# EAGLE schematic coke (EAGLE 5.06)
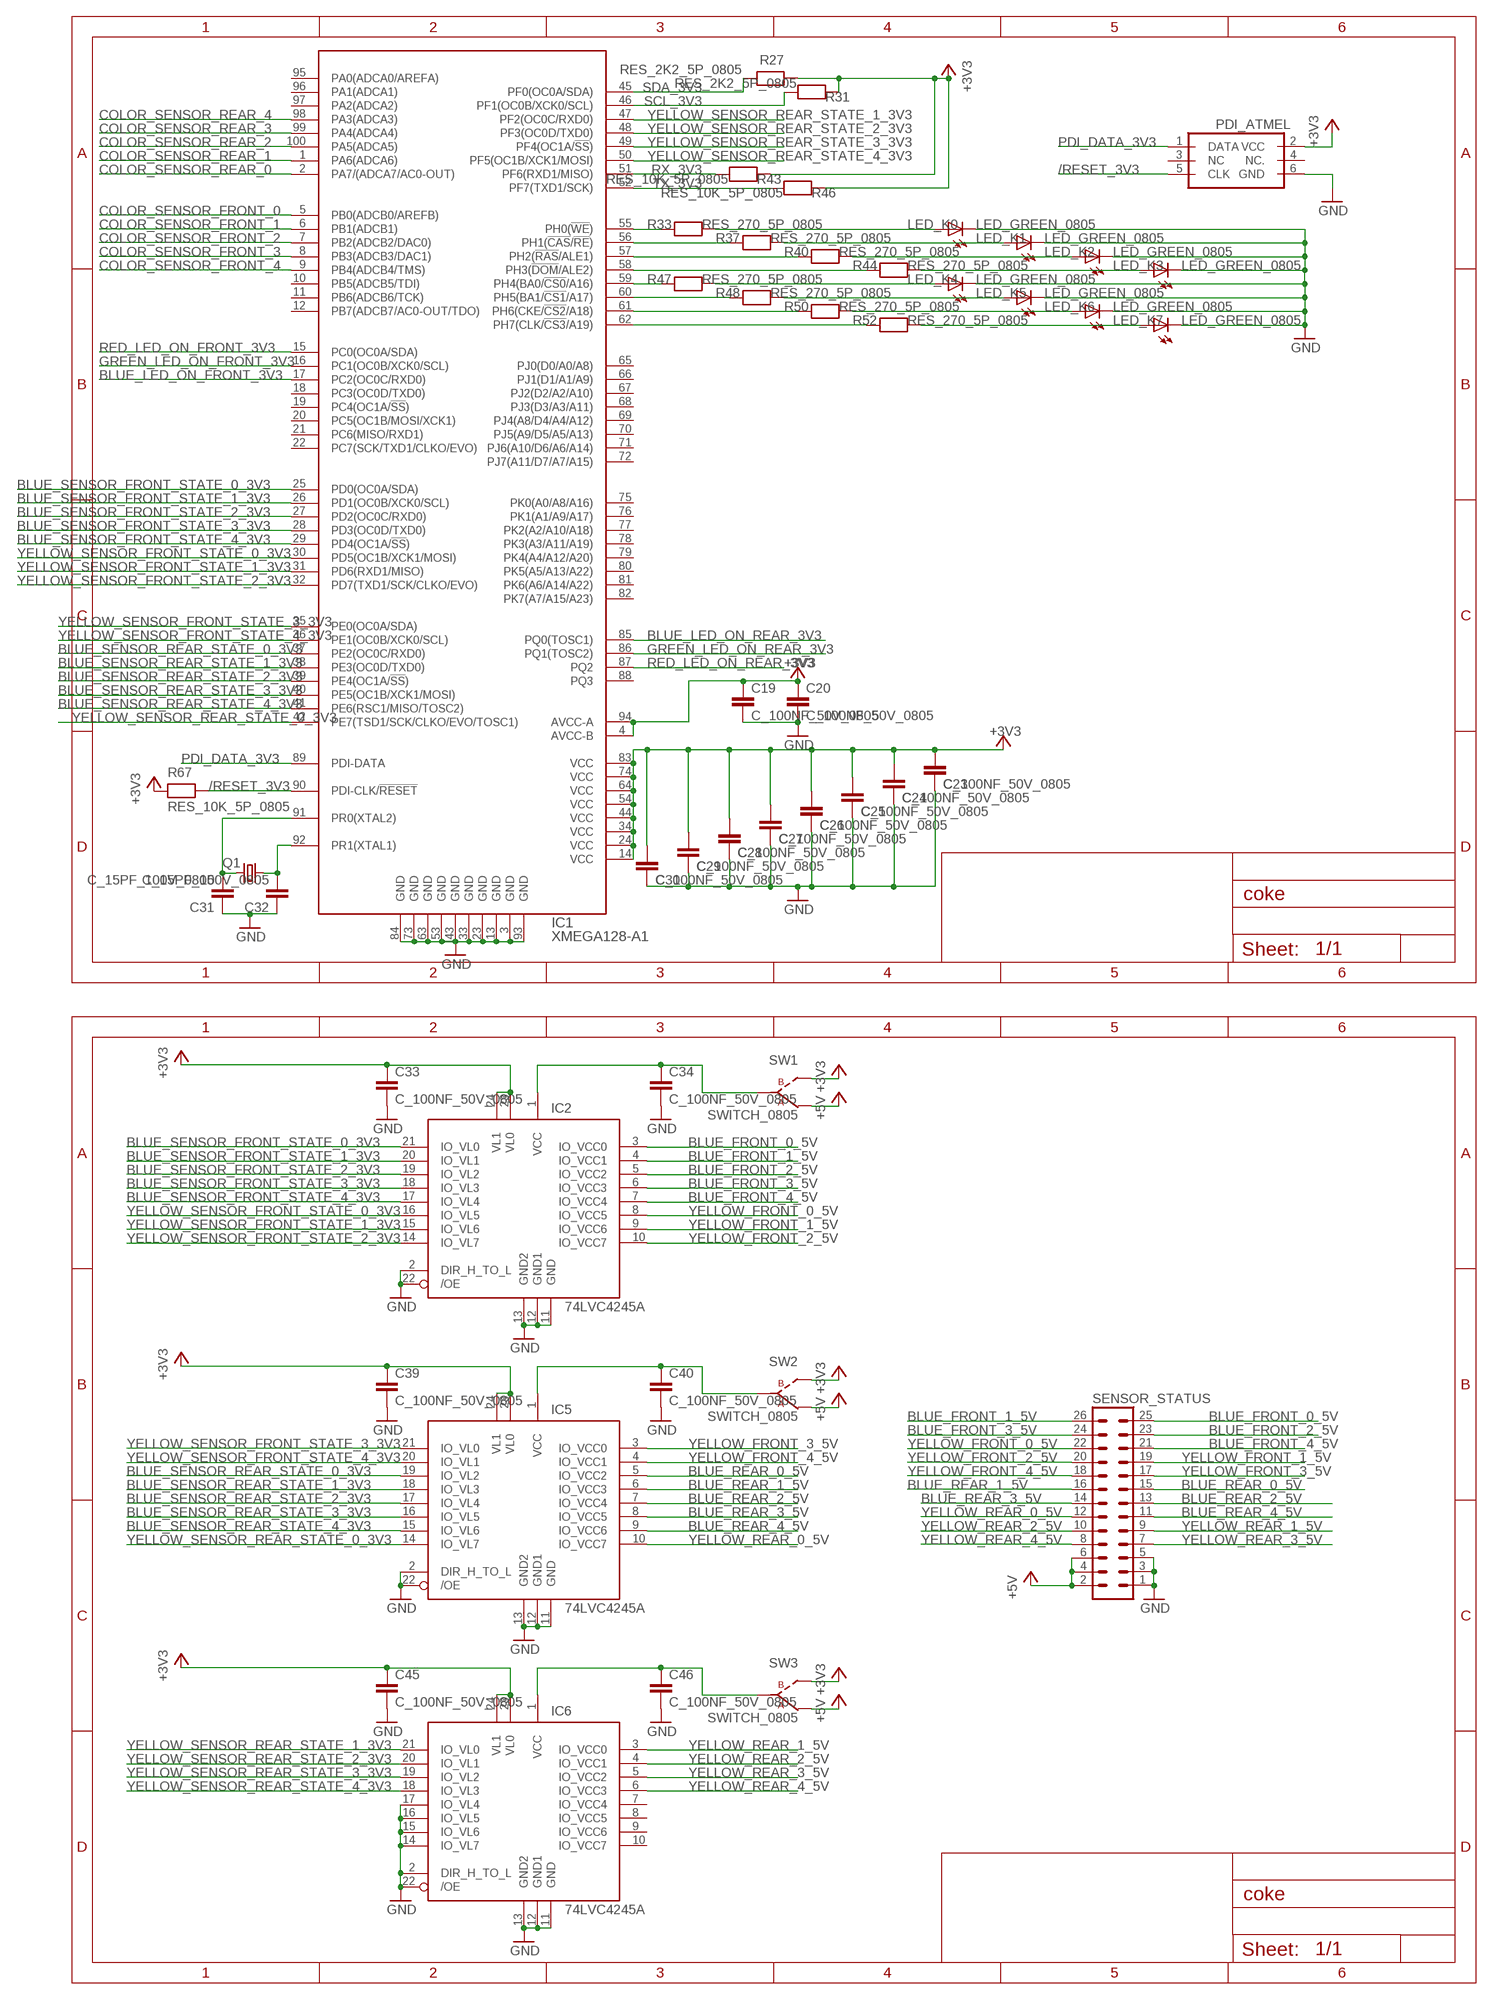
[diagram p0: schematic, sheet 1, part 1 of 2]
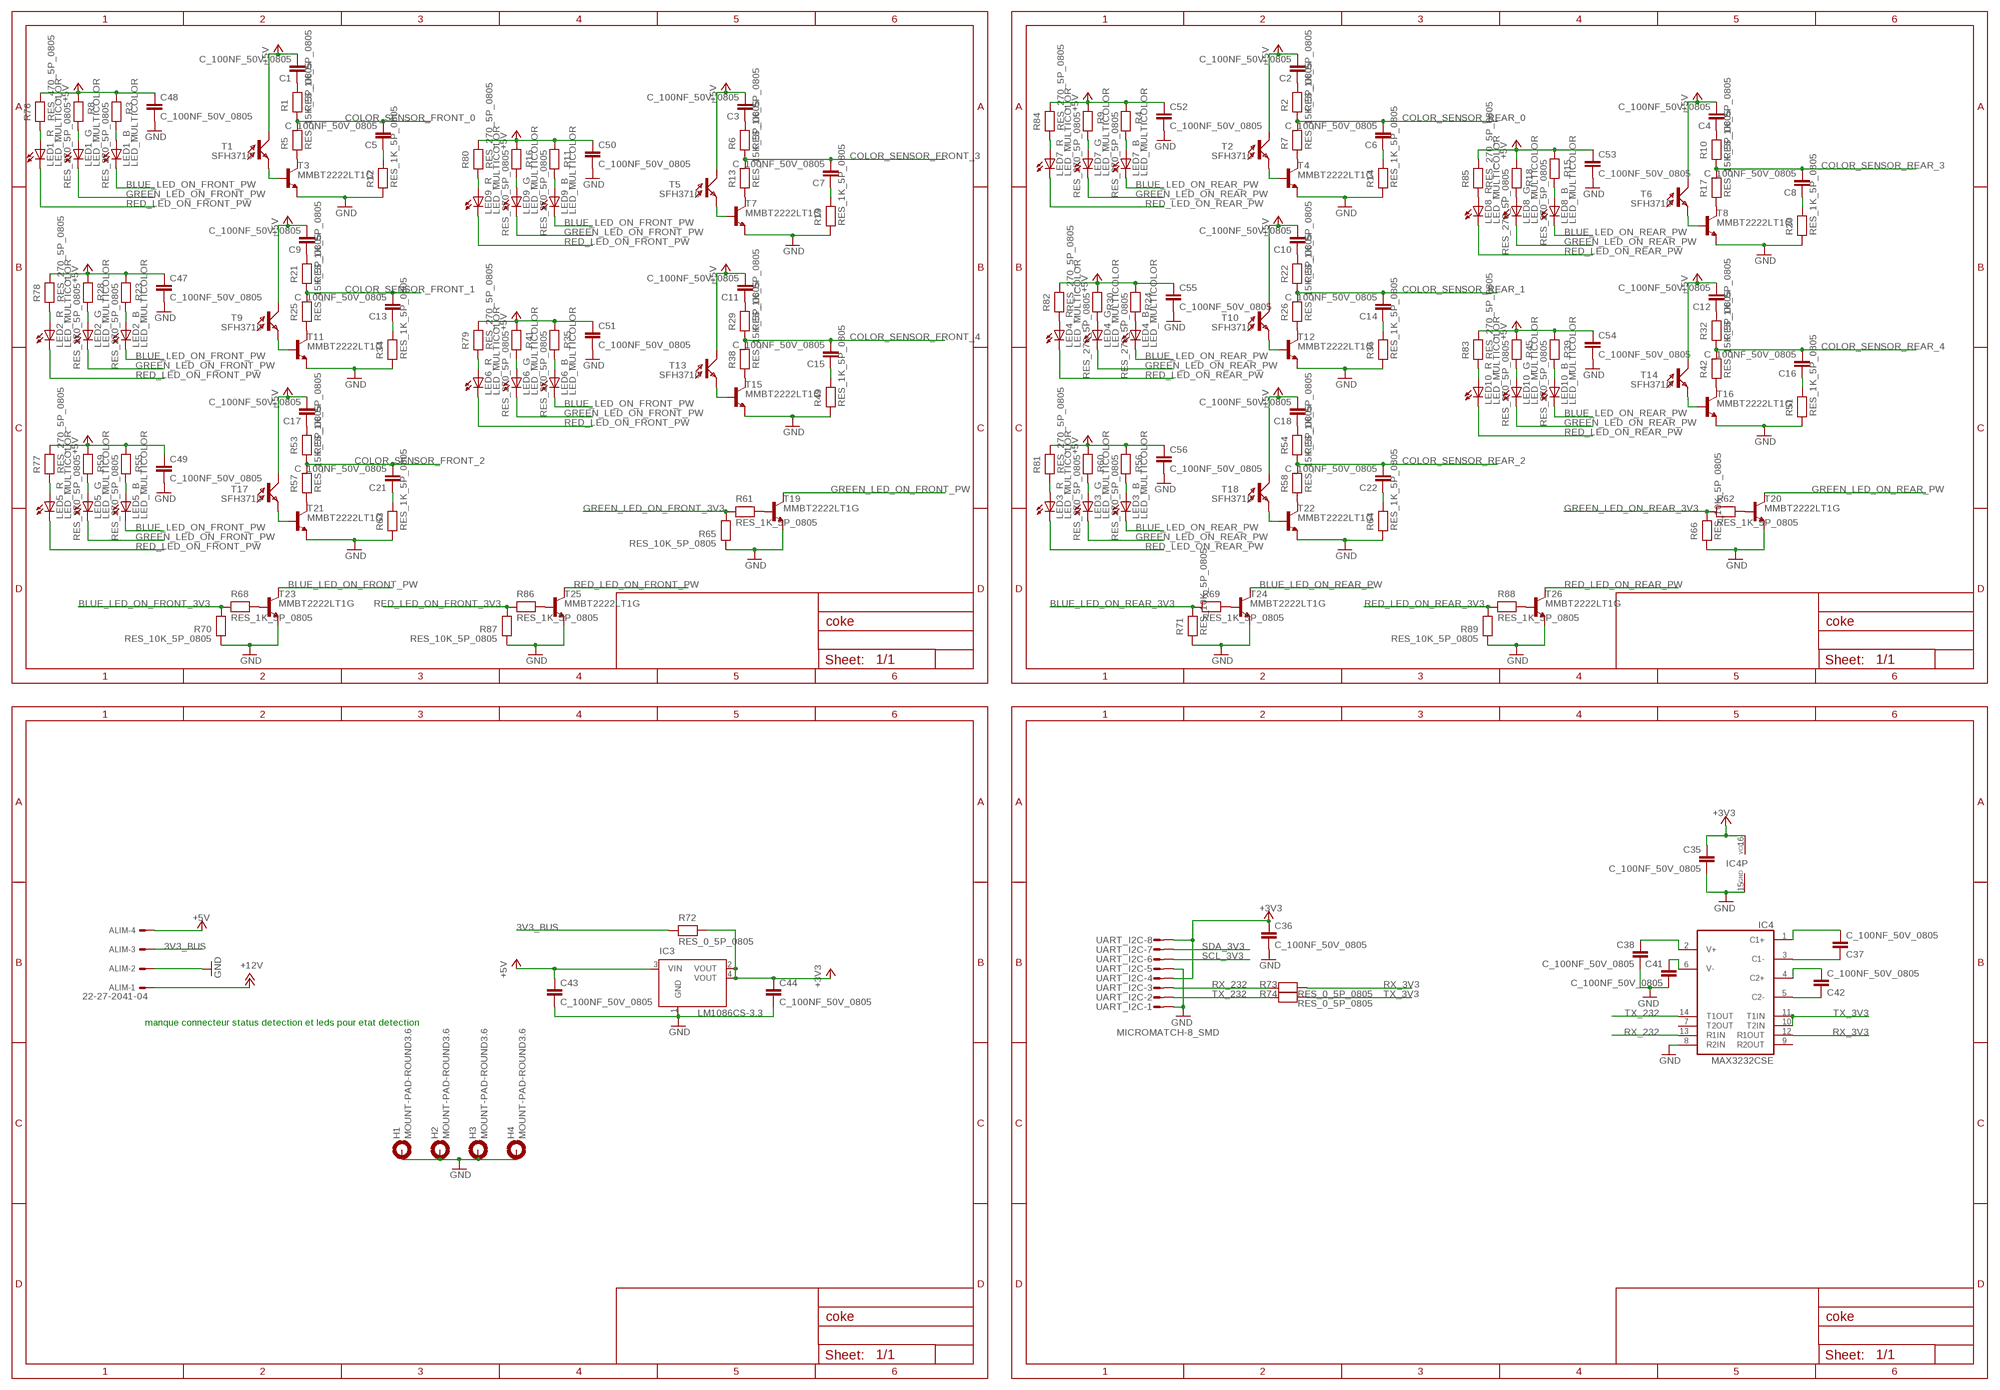
[diagram p1: schematic, sheet 1, part 2 of 2]

## Parts
ALIM  22-27-2041-04  [6410-04]
C1  C_100NF_50V_0805  [C0805]
C2  C_100NF_50V_0805  [C0805]
C3  C_100NF_50V_0805  [C0805]
C4  C_100NF_50V_0805  [C0805]
C5  C_100NF_50V_0805  [C0805]
C6  C_100NF_50V_0805  [C0805]
C7  C_100NF_50V_0805  [C0805]
C8  C_100NF_50V_0805  [C0805]
C9  C_100NF_50V_0805  [C0805]
C10  C_100NF_50V_0805  [C0805]
C11  C_100NF_50V_0805  [C0805]
C12  C_100NF_50V_0805  [C0805]
C13  C_100NF_50V_0805  [C0805]
C14  C_100NF_50V_0805  [C0805]
C15  C_100NF_50V_0805  [C0805]
C16  C_100NF_50V_0805  [C0805]
C17  C_100NF_50V_0805  [C0805]
C18  C_100NF_50V_0805  [C0805]
C19  C_100NF_50V_0805  [C0805]
C20  C_100NF_50V_0805  [C0805]
C21  C_100NF_50V_0805  [C0805]
C22  C_100NF_50V_0805  [C0805]
C23  C_100NF_50V_0805  [C0805]
C24  C_100NF_50V_0805  [C0805]
C25  C_100NF_50V_0805  [C0805]
C26  C_100NF_50V_0805  [C0805]
C27  C_100NF_50V_0805  [C0805]
C28  C_100NF_50V_0805  [C0805]
C29  C_100NF_50V_0805  [C0805]
C30  C_100NF_50V_0805  [C0805]
C31  C_15PF_100V_0805  [C0805]
C32  C_15PF_100V_0805  [C0805]
C33  C_100NF_50V_0805  [C0805]
C34  C_100NF_50V_0805  [C0805]
C35  C_100NF_50V_0805  [C0805]
C36  C_100NF_50V_0805  [C0805]
C37  C_100NF_50V_0805  [C0805]
C38  C_100NF_50V_0805  [C0805]
C39  C_100NF_50V_0805  [C0805]
C40  C_100NF_50V_0805  [C0805]
C41  C_100NF_50V_0805  [C0805]
C42  C_100NF_50V_0805  [C0805]
C43  C_100NF_50V_0805  [C0805]
C44  C_100NF_50V_0805  [C0805]
C45  C_100NF_50V_0805  [C0805]
C46  C_100NF_50V_0805  [C0805]
C47  C_100NF_50V_0805  [C0805]
C48  C_100NF_50V_0805  [C0805]
C49  C_100NF_50V_0805  [C0805]
C50  C_100NF_50V_0805  [C0805]
C51  C_100NF_50V_0805  [C0805]
C52  C_100NF_50V_0805  [C0805]
C53  C_100NF_50V_0805  [C0805]
C54  C_100NF_50V_0805  [C0805]
C55  C_100NF_50V_0805  [C0805]
C56  C_100NF_50V_0805  [C0805]
H1  MOUNT-PAD-ROUND3.6  [3,6-PAD]
H2  MOUNT-PAD-ROUND3.6  [3,6-PAD]
H3  MOUNT-PAD-ROUND3.6  [3,6-PAD]
H4  MOUNT-PAD-ROUND3.6  [3,6-PAD]
IC1  XMEGA128-A1  XMEGA-A1TQFP  [TQFP100]
IC2  74LVC4245A  [TSSOP24]
IC3  LM1086CS-3.3  [TO263]
IC4  MAX3232CSE  [SO16]
IC5  74LVC4245A  [TSSOP24]
IC6  74LVC4245A  [TSSOP24]
LED1  LED_MULTICOLOR  [PLCC6]
LED2  LED_MULTICOLOR  [PLCC6]
LED3  LED_MULTICOLOR  [PLCC6]
LED4  LED_MULTICOLOR  [PLCC6]
LED5  LED_MULTICOLOR  [PLCC6]
LED6  LED_MULTICOLOR  [PLCC6]
LED7  LED_MULTICOLOR  [PLCC6]
LED8  LED_MULTICOLOR  [PLCC6]
LED9  LED_MULTICOLOR  [PLCC6]
LED10  LED_MULTICOLOR  [PLCC6]
LED_K0  LED_GREEN_0805  [CHIP-LED0805]
LED_K1  LED_GREEN_0805  [CHIP-LED0805]
LED_K2  LED_GREEN_0805  [CHIP-LED0805]
LED_K3  LED_GREEN_0805  [CHIP-LED0805]
LED_K4  LED_GREEN_0805  [CHIP-LED0805]
LED_K5  LED_GREEN_0805  [CHIP-LED0805]
LED_K6  LED_GREEN_0805  [CHIP-LED0805]
LED_K7  LED_GREEN_0805  [CHIP-LED0805]
PDI_ATMEL  PDI_ATMEL  [ML6]
Q1  CRYSTAL_16MHZ_HC49UP  [HC49UP]
R1  RES_1K_5P_0805  [R0805]
R2  RES_1K_5P_0805  [R0805]
R3  RES_270_5P_0805  [R0805]
R4  RES_270_5P_0805  [R0805]
R5  RES_15K_5P_0805  [R0805]
R6  RES_1K_5P_0805  [R0805]
R7  RES_15K_5P_0805  [R0805]
R8  RES_270_5P_0805  [R0805]
R9  RES_270_5P_0805  [R0805]
R10  RES_1K_5P_0805  [R0805]
R11  RES_270_5P_0805  [R0805]
R12  RES_1K_5P_0805  [R0805]
R13  RES_15K_5P_0805  [R0805]
R14  RES_1K_5P_0805  [R0805]
R15  RES_270_5P_0805  [R0805]
R16  RES_270_5P_0805  [R0805]
R17  RES_15K_5P_0805  [R0805]
R18  RES_270_5P_0805  [R0805]
R19  RES_1K_5P_0805  [R0805]
R20  RES_1K_5P_0805  [R0805]
R21  RES_1K_5P_0805  [R0805]
R22  RES_1K_5P_0805  [R0805]
R23  RES_270_5P_0805  [R0805]
R24  RES_270_5P_0805  [R0805]
R25  RES_15K_5P_0805  [R0805]
R26  RES_15K_5P_0805  [R0805]
R27  RES_2K2_5P_0805  [R0805]
R28  RES_270_5P_0805  [R0805]
R29  RES_1K_5P_0805  [R0805]
R30  RES_270_5P_0805  [R0805]
R31  RES_2K2_5P_0805  [R0805]
R32  RES_1K_5P_0805  [R0805]
R33  RES_270_5P_0805  [R0805]
R34  RES_1K_5P_0805  [R0805]
R35  RES_270_5P_0805  [R0805]
R36  RES_1K_5P_0805  [R0805]
R37  RES_270_5P_0805  [R0805]
R38  RES_15K_5P_0805  [R0805]
R39  RES_270_5P_0805  [R0805]
R40  RES_270_5P_0805  [R0805]
R41  RES_270_5P_0805  [R0805]
R42  RES_15K_5P_0805  [R0805]
R43  RES_10K_5P_0805  [R0805]
R44  RES_270_5P_0805  [R0805]
R45  RES_270_5P_0805  [R0805]
R46  RES_10K_5P_0805  [R0805]
R47  RES_270_5P_0805  [R0805]
R48  RES_270_5P_0805  [R0805]
R49  RES_1K_5P_0805  [R0805]
R50  RES_270_5P_0805  [R0805]
R51  RES_1K_5P_0805  [R0805]
R52  RES_270_5P_0805  [R0805]
R53  RES_1K_5P_0805  [R0805]
R54  RES_1K_5P_0805  [R0805]
R55  RES_270_5P_0805  [R0805]
R56  RES_270_5P_0805  [R0805]
R57  RES_15K_5P_0805  [R0805]
R58  RES_15K_5P_0805  [R0805]
R59  RES_270_5P_0805  [R0805]
R60  RES_270_5P_0805  [R0805]
R61  RES_1K_5P_0805  [R0805]
R62  RES_1K_5P_0805  [R0805]
R63  RES_1K_5P_0805  [R0805]
R64  RES_1K_5P_0805  [R0805]
R65  RES_10K_5P_0805  [R0805]
R66  RES_10K_5P_0805  [R0805]
R67  RES_10K_5P_0805  [R0805]
R68  RES_1K_5P_0805  [R0805]
R69  RES_1K_5P_0805  [R0805]
R70  RES_10K_5P_0805  [R0805]
R71  RES_10K_5P_0805  [R0805]
R72  RES_0_5P_0805  [R0805]
R73  RES_0_5P_0805  [R0805]
R74  RES_0_5P_0805  [R0805]
R76  RES_470_5P_0805  [R0805]
R77  RES_270_5P_0805  [R0805]
R78  RES_270_5P_0805  [R0805]
R79  RES_270_5P_0805  [R0805]
R80  RES_270_5P_0805  [R0805]
R81  RES_270_5P_0805  [R0805]
R82  RES_270_5P_0805  [R0805]
R83  RES_270_5P_0805  [R0805]
R84  RES_270_5P_0805  [R0805]
R85  RES_270_5P_0805  [R0805]
R86  RES_1K_5P_0805  [R0805]
R87  RES_10K_5P_0805  [R0805]
R88  RES_1K_5P_0805  [R0805]
R89  RES_10K_5P_0805  [R0805]
SENSOR_STATUS  ML26  [ML26]
SW1  SWITCH_0805  [SWITCH_0805]
SW2  SWITCH_0805  [SWITCH_0805]
SW3  SWITCH_0805  [SWITCH_0805]
T1  SFH3710  [SFH3710]
T2  SFH3710  [SFH3710]
T3  MMBT2222LT1G  MMBT2222ALT1-NPN-SOT23-BEC  [SOT23-BEC]
T4  MMBT2222LT1G  MMBT2222ALT1-NPN-SOT23-BEC  [SOT23-BEC]
T5  SFH3710  [SFH3710]
T6  SFH3710  [SFH3710]
T7  MMBT2222LT1G  MMBT2222ALT1-NPN-SOT23-BEC  [SOT23-BEC]
T8  MMBT2222LT1G  MMBT2222ALT1-NPN-SOT23-BEC  [SOT23-BEC]
T9  SFH3710  [SFH3710]
T10  SFH3710  [SFH3710]
T11  MMBT2222LT1G  MMBT2222ALT1-NPN-SOT23-BEC  [SOT23-BEC]
T12  MMBT2222LT1G  MMBT2222ALT1-NPN-SOT23-BEC  [SOT23-BEC]
T13  SFH3710  [SFH3710]
T14  SFH3710  [SFH3710]
T15  MMBT2222LT1G  MMBT2222ALT1-NPN-SOT23-BEC  [SOT23-BEC]
T16  MMBT2222LT1G  MMBT2222ALT1-NPN-SOT23-BEC  [SOT23-BEC]
T17  SFH3710  [SFH3710]
T18  SFH3710  [SFH3710]
T19  MMBT2222LT1G  MMBT2222ALT1-NPN-SOT23-BEC  [SOT23-BEC]
T20  MMBT2222LT1G  MMBT2222ALT1-NPN-SOT23-BEC  [SOT23-BEC]
T21  MMBT2222LT1G  MMBT2222ALT1-NPN-SOT23-BEC  [SOT23-BEC]
T22  MMBT2222LT1G  MMBT2222ALT1-NPN-SOT23-BEC  [SOT23-BEC]
T23  MMBT2222LT1G  MMBT2222ALT1-NPN-SOT23-BEC  [SOT23-BEC]
T24  MMBT2222LT1G  MMBT2222ALT1-NPN-SOT23-BEC  [SOT23-BEC]
T25  MMBT2222LT1G  MMBT2222ALT1-NPN-SOT23-BEC  [SOT23-BEC]
T26  MMBT2222LT1G  MMBT2222ALT1-NPN-SOT23-BEC  [SOT23-BEC]
UART_I2C  MICROMATCH-8_SMD  [MICROMATCH-8_SMD]

## Nets
3V3_BUS: ALIM.3 R72.1
+3V3: C19.1 C20.1 C23.1 C24.1 C25.1 C26.1 C27.1 C28.1 C29.1 C30.1 C33.1 C35.1 C36.1 C39.1 C44.1 C45.1 IC1.4(AVCC-B) IC1.14(VCC) IC1.24(VCC) IC1.34(VCC) IC1.44(VCC) IC1.54(VCC) IC1.64(VCC) IC1.74(VCC) IC1.83(VCC) IC1.94(AVCC-A) IC2.23(VL0) IC2.24(VL1) IC3.2(VOUT) IC3.4(VOUT) IC4.16(VCC) IC5.23(VL0) IC5.24(VL1) IC6.23(VL0) IC6.24(VL1) PDI_ATMEL.2(VCC) R27.2 R31.2 R43.1 R46.2 R67.1 R72.2 SW1.2 SW2.2 SW3.2 UART_I2C.4 UART_I2C.8
+5V: ALIM.4 C1.2 C2.2 C3.2 C4.2 C9.2 C10.2 C11.2 C12.2 C17.2 C18.2 C43.1 C47.1 C48.1 C49.1 C50.1 C51.1 C52.1 C53.1 C54.1 C55.1 C56.1 IC3.3(VIN) R3.1 R4.1 R8.1 R9.1 R11.1 R15.1 R16.1 R18.1 R23.1 R24.1 R28.1 R30.1 R35.1 R39.1 R41.1 R45.1 R55.1 R56.1 R59.1 R60.1 R76.2 R77.2 R78.2 R79.2 R80.2 R81.2 R82.2 R83.2 R84.2 R85.2 SENSOR_STATUS.2 SENSOR_STATUS.4 SENSOR_STATUS.6 SW1.3 SW2.3 SW3.3 T1.C T2.C T5.C T6.C T9.C T10.C T13.C T14.C T17.C T18.C
+12V: ALIM.1
/RESET_3V3: IC1.90(PDI-CLK/!RESET) PDI_ATMEL.5(CLK) R67.2
BLUE_FRONT_0_5V: IC2.3(IO_VCC0) SENSOR_STATUS.25
BLUE_FRONT_1_5V: IC2.4(IO_VCC1) SENSOR_STATUS.26
BLUE_FRONT_2_5V: IC2.5(IO_VCC2) SENSOR_STATUS.23
BLUE_FRONT_3_5V: IC2.6(IO_VCC3) SENSOR_STATUS.24
BLUE_FRONT_4_5V: IC2.7(IO_VCC4) SENSOR_STATUS.21
BLUE_LED_ON_FRONT_3V3: IC1.17(PC2(OC0C/RXD0)) R68.1 R70.2
BLUE_LED_ON_FRONT_PW: LED1.1(_B:C) LED2.1(_B:C) LED5.1(_B:C) LED6.1(_B:C) LED9.1(_B:C) T23.C
BLUE_LED_ON_REAR_3V3: IC1.85(PQ0(TOSC1)) R69.1 R71.2
BLUE_LED_ON_REAR_PW: LED3.1(_B:C) LED4.1(_B:C) LED7.1(_B:C) LED8.1(_B:C) LED10.1(_B:C) T24.C
BLUE_REAR_0_5V: IC5.5(IO_VCC2) SENSOR_STATUS.15
BLUE_REAR_1_5V: IC5.6(IO_VCC3) SENSOR_STATUS.16
BLUE_REAR_2_5V: IC5.7(IO_VCC4) SENSOR_STATUS.13
BLUE_REAR_3_5V: IC5.8(IO_VCC5) SENSOR_STATUS.14
BLUE_REAR_4_5V: IC5.9(IO_VCC6) SENSOR_STATUS.11
BLUE_SENSOR_FRONT_STATE_0_3V3: IC1.25(PD0(OC0A/SDA)) IC2.21(IO_VL0)
BLUE_SENSOR_FRONT_STATE_1_3V3: IC1.26(PD1(OC0B/XCK0/SCL)) IC2.20(IO_VL1)
BLUE_SENSOR_FRONT_STATE_2_3V3: IC1.27(PD2(OC0C/RXD0)) IC2.19(IO_VL2)
BLUE_SENSOR_FRONT_STATE_3_3V3: IC1.28(PD3(OC0D/TXD0)) IC2.18(IO_VL3)
BLUE_SENSOR_FRONT_STATE_4_3V3: IC1.29(PD4(OC1A/!SS!)) IC2.17(IO_VL4)
BLUE_SENSOR_REAR_STATE_0_3V3: IC1.37(PE2(OC0C/RXD0)) IC5.19(IO_VL2)
BLUE_SENSOR_REAR_STATE_1_3V3: IC1.38(PE3(OC0D/TXD0)) IC5.18(IO_VL3)
BLUE_SENSOR_REAR_STATE_2_3V3: IC1.39(PE4(OC1A/!SS!)) IC5.17(IO_VL4)
BLUE_SENSOR_REAR_STATE_3_3V3: IC1.40(PE5(OC1B/XCK1/MOSI)) IC5.16(IO_VL5)
BLUE_SENSOR_REAR_STATE_4_3V3: IC1.41(PE6(RSC1/MISO/TOSC2)) IC5.15(IO_VL6)
COLOR_SENSOR_FRONT_0: C5.2 IC1.5(PB0(ADCB0/AREFB)) R1.1 R5.2
COLOR_SENSOR_FRONT_1: C13.2 IC1.6(PB1(ADCB1)) R21.1 R25.2
COLOR_SENSOR_FRONT_2: C21.2 IC1.7(PB2(ADCB2/DAC0)) R53.1 R57.2
COLOR_SENSOR_FRONT_3: C7.2 IC1.8(PB3(ADCB3/DAC1)) R6.1 R13.2
COLOR_SENSOR_FRONT_4: C15.2 IC1.9(PB4(ADCB4/TMS)) R29.1 R38.2
COLOR_SENSOR_REAR_0: C6.2 IC1.2(PA7/(ADCA7/AC0-OUT)) R2.1 R7.2
COLOR_SENSOR_REAR_1: C14.2 IC1.1(PA6(ADCA6)) R22.1 R26.2
COLOR_SENSOR_REAR_2: C22.2 IC1.100(PA5(ADCA5)) R54.1 R58.2
COLOR_SENSOR_REAR_3: C8.2 IC1.99(PA4(ADCA4)) R10.1 R17.2
COLOR_SENSOR_REAR_4: C16.2 IC1.98(PA3(ADCA3)) R32.1 R42.2
GND: ALIM.2 C19.2 C20.2 C23.2 C24.2 C25.2 C26.2 C27.2 C28.2 C29.2 C30.2 C31.1 C32.1 C33.2 C34.2 C35.2 C36.2 C38.2 C39.2 C40.2 C41.2 C43.2 C44.2 C45.2 C46.2 C47.2 C48.2 C49.2 C50.2 C51.2 C52.2 C53.2 C54.2 C55.2 C56.2 H1.B3,6(MOUNT) H2.B3,6(MOUNT) H3.B3,6(MOUNT) H4.B3,6(MOUNT) IC1.3(GND) IC1.13(GND) IC1.23(GND) IC1.33(GND) IC1.43(GND) IC1.53(GND) IC1.63(GND) IC1.73(GND) IC1.84(GND) IC1.93(GND) IC2.2(DIR_H_TO_L) IC2.11(GND) IC2.12(GND1) IC2.13(GND2) IC2.22(/OE) IC3.1(GND) IC4.8(R2IN) IC4.15(GND) IC5.2(DIR_H_TO_L) IC5.11(GND) IC5.12(GND1) IC5.13(GND2) IC5.22(/OE) IC6.2(DIR_H_TO_L) IC6.11(GND) IC6.12(GND1) IC6.13(GND2) IC6.14(IO_VL7) IC6.15(IO_VL6) IC6.16(IO_VL5) IC6.17(IO_VL4) IC6.22(/OE) LED_K0.C LED_K1.C LED_K2.C LED_K3.C LED_K4.C LED_K5.C LED_K6.C LED_K7.C PDI_ATMEL.6(GND) R12.1 R14.1 R19.1 R20.1 R34.1 R36.1 R49.1 R51.1 R63.1 R64.1 R65.1 R66.1 R70.1 R71.1 R87.1 R89.1 SENSOR_STATUS.1 SENSOR_STATUS.3 SENSOR_STATUS.5 T3.E T4.E T7.E T8.E T11.E T12.E T15.E T16.E T19.E T20.E T21.E T22.E T23.E T24.E T25.E T26.E UART_I2C.1 UART_I2C.5
GREEN_LED_ON_FRONT_3V3: IC1.16(PC1(OC0B/XCK0/SCL)) R61.1 R65.2
GREEN_LED_ON_FRONT_PW: LED1.2(_G:C) LED2.2(_G:C) LED5.2(_G:C) LED6.2(_G:C) LED9.2(_G:C) T19.C
GREEN_LED_ON_REAR_3V3: IC1.86(PQ1(TOSC2)) R62.1 R66.2
GREEN_LED_ON_REAR_PW: LED3.2(_G:C) LED4.2(_G:C) LED7.2(_G:C) LED8.2(_G:C) LED10.2(_G:C) T20.C
N$1: C37.1 IC4.1(C1+)
N$2: LED1.5(_G:A) R8.2
N$3: LED2.5(_G:A) R28.2
N$4: LED5.6(_B:A) R55.2
N$5: C37.2 IC4.3(C1-)
N$6: C42.1 IC4.4(C2+)
N$7: C13.1 R34.2
N$8: LED1.6(_B:A) R3.2
N$9: T9.E T11.B
N$10: C9.1 R21.2
N$11: C38.1 IC4.2(V+)
N$12: C21.1 R63.2
N$13: C41.1 IC4.6(V-)
N$14: LED5.5(_G:A) R59.2
N$15: LED2.6(_B:A) R23.2
N$16: T17.E T21.B
N$17: C17.1 R53.2
N$18: C5.1 R12.2
N$19: R5.1 T3.C
N$20: C7.1 R19.2
N$21: T5.E T7.B
N$22: C3.1 R6.2
N$23: T1.E T3.B
N$24: C42.2 IC4.5(C2-)
N$25: C1.1 R1.2
N$26: C15.1 R49.2
N$27: LED9.5(_G:A) R16.2
N$28: LED9.6(_B:A) R11.2
N$29: T13.E T15.B
N$30: C11.1 R29.2
N$31: R25.1 T11.C
N$32: C6.1 R14.2
N$33: T2.E T4.B
N$34: C2.1 R2.2
N$35: LED6.5(_G:A) R41.2
N$36: LED6.6(_B:A) R35.2
N$37: R57.1 T21.C
N$38: C14.1 R36.2
N$39: T10.E T12.B
N$40: C10.1 R22.2
N$41: R13.1 T7.C
N$42: C22.1 R64.2
N$43: LED3.5(_G:A) R60.2
N$44: LED3.6(_B:A) R56.2
N$45: C31.2 IC1.91(PR0(XTAL2)) Q1.2
N$46: C32.2 IC1.92(PR1(XTAL1)) Q1.1
N$47: T18.E T22.B
N$48: C18.1 R54.2
N$49: R38.1 T15.C
N$50: C8.1 R20.2
N$51: T6.E T8.B
N$52: C4.1 R10.2
N$53: LED4.5(_G:A) R30.2
N$54: LED4.6(_B:A) R24.2
N$55: LED1.4(_R:A) R76.1
N$56: C16.1 R51.2
N$57: T14.E T16.B
N$58: C12.1 R32.2
N$59: IC1.55(PH0(!WE!)) R33.1
N$60: IC1.56(PH1(!CAS!/!RE!)) R37.1
N$61: LED7.5(_G:A) R9.2
N$62: LED7.6(_B:A) R4.2
N$63: IC1.57(PH2(!RAS!/ALE1)) R40.1
N$64: LED5.4(_R:A) R77.1
N$65: LED2.4(_R:A) R78.1
N$66: LED6.4(_R:A) R79.1
N$67: LED9.4(_R:A) R80.1
N$68: R7.1 T4.C
N$69: LED10.5(_G:A) R45.2
N$70: LED8.6(_B:A) R15.2
N$71: R26.1 T12.C
N$72: R58.1 T22.C
N$73: R69.2 T24.B
N$74: R68.2 T23.B
N$75: R61.2 T19.B
N$76: R62.2 T20.B
N$77: LED8.5(_G:A) R18.2
N$78: LED10.6(_B:A) R39.2
N$79: R42.1 T16.C
N$80: R17.1 T8.C
N$81: LED4.4(_R:A) R82.1
N$82: LED10.4(_R:A) R83.1
N$83: LED7.4(_R:A) R84.1
N$84: LED8.4(_R:A) R85.1
N$85: LED3.4(_R:A) R81.1
N$86: R86.2 T25.B
N$87: IC1.58(PH3(!DOM!/ALE2)) R44.1
N$88: IC1.59(PH4(BA0/!CS0!/A16)) R47.1
N$89: IC1.60(PH5(BA1/!CS1!/A17)) R48.1
N$90: IC1.61(PH6(CKE/!CS2!/A18)) R50.1
N$91: LED_K0.A R33.2
N$92: LED_K1.A R37.2
N$93: LED_K2.A R40.2
N$94: LED_K3.A R44.2
N$95: R88.2 T26.B
N$96: IC1.62(PH7(CLK/!CS3!/A19)) R52.1
N$100: LED_K4.A R47.2
N$101: LED_K5.A R48.2
N$102: LED_K6.A R50.2
N$103: LED_K7.A R52.2
N$113: C34.1 IC2.1(VCC) SW1.1
N$130: C40.1 IC5.1(VCC) SW2.1
N$131: C46.1 IC6.1(VCC) SW3.1
PDI_DATA_3V3: IC1.89(PDI-DATA) PDI_ATMEL.1(DATA)
RED_LED_ON_FRONT_3V3: IC1.15(PC0(OC0A/SDA)) R86.1 R87.2
RED_LED_ON_FRONT_PW: LED1.3(_R:C) LED2.3(_R:C) LED5.3(_R:C) LED6.3(_R:C) LED9.3(_R:C) T25.C
RED_LED_ON_REAR_3V3: IC1.87(PQ2) R88.1 R89.2
RED_LED_ON_REAR_PW: LED3.3(_R:C) LED4.3(_R:C) LED7.3(_R:C) LED8.3(_R:C) LED10.3(_R:C) T26.C
RX_3V3: IC1.51(PF6(RXD1/MISO)) IC4.12(R1OUT) R43.2 R73.2
RX_232: IC4.13(R1IN) R73.1 UART_I2C.3
SCL_3V3: IC1.46(PF1(OC0B/XCK0/SCL)) R31.1 UART_I2C.6
SDA_3V3: IC1.45(PF0(OC0A/SDA)) R27.1 UART_I2C.7
TX_3V3: IC1.52(PF7(TXD1/SCK)) IC4.10(T2IN) IC4.11(T1IN) R46.1 R74.2
TX_232: IC4.14(T1OUT) R74.1 UART_I2C.2
YELLOW_FRONT_0_5V: IC2.8(IO_VCC5) SENSOR_STATUS.22
YELLOW_FRONT_1_5V: IC2.9(IO_VCC6) SENSOR_STATUS.19
YELLOW_FRONT_2_5V: IC2.10(IO_VCC7) SENSOR_STATUS.20
YELLOW_FRONT_3_5V: IC5.3(IO_VCC0) SENSOR_STATUS.17
YELLOW_FRONT_4_5V: IC5.4(IO_VCC1) SENSOR_STATUS.18
YELLOW_REAR_0_5V: IC5.10(IO_VCC7) SENSOR_STATUS.12
YELLOW_REAR_1_5V: IC6.3(IO_VCC0) SENSOR_STATUS.9
YELLOW_REAR_2_5V: IC6.4(IO_VCC1) SENSOR_STATUS.10
YELLOW_REAR_3_5V: IC6.5(IO_VCC2) SENSOR_STATUS.7
YELLOW_REAR_4_5V: IC6.6(IO_VCC3) SENSOR_STATUS.8
YELLOW_SENSOR_FRONT_STATE_0_3V3: IC1.30(PD5(OC1B/XCK1/MOSI)) IC2.16(IO_VL5)
YELLOW_SENSOR_FRONT_STATE_1_3V3: IC1.31(PD6(RXD1/MISO)) IC2.15(IO_VL6)
YELLOW_SENSOR_FRONT_STATE_2_3V3: IC1.32(PD7(TXD1/SCK/CLKO/EVO)) IC2.14(IO_VL7)
YELLOW_SENSOR_FRONT_STATE_3_3V3: IC1.35(PE0(OC0A/SDA)) IC5.21(IO_VL0)
YELLOW_SENSOR_FRONT_STATE_4_3V3: IC1.36(PE1(OC0B/XCK0/SCL)) IC5.20(IO_VL1)
YELLOW_SENSOR_REAR_STATE_0_3V3: IC1.42(PE7(TSD1/SCK/CLKO/EVO/TOSC1)) IC5.14(IO_VL7)
YELLOW_SENSOR_REAR_STATE_1_3V3: IC1.47(PF2(OC0C/RXD0)) IC6.21(IO_VL0)
YELLOW_SENSOR_REAR_STATE_2_3V3: IC1.48(PF3(OC0D/TXD0)) IC6.20(IO_VL1)
YELLOW_SENSOR_REAR_STATE_3_3V3: IC1.49(PF4(OC1A/!SS!)) IC6.19(IO_VL2)
YELLOW_SENSOR_REAR_STATE_4_3V3: IC1.50(PF5(OC1B/XCK1/MOSI)) IC6.18(IO_VL3)
Unconnected: IC1.10(PB5(ADCB5/TDI)) IC1.11(PB6(ADCB6/TCK)) IC1.12(PB7(ADCB7/AC0-OUT/TDO)) IC1.18(PC3(OC0D/TXD0)) IC1.19(PC4(OC1A/!SS!)) IC1.20(PC5(OC1B/MOSI/XCK1)) IC1.21(PC6(MISO/RXD1)) IC1.22(PC7(SCK/TXD1/CLKO/EVO)) IC1.65(PJ0(D0/A0/A8)) IC1.66(PJ1(D1/A1/A9)) IC1.67(PJ2(D2/A2/A10)) IC1.68(PJ3(D3/A3/A11)) IC1.69(PJ4(A8/D4/A4/A12)) IC1.70(PJ5(A9/D5/A5/A13)) IC1.71(PJ6(A10/D6/A6/A14)) IC1.72(PJ7(A11/D7/A7/A15)) IC1.75(PK0(A0/A8/A16)) IC1.76(PK1(A1/A9/A17)) IC1.77(PK2(A2/A10/A18)) IC1.78(PK3(A3/A11/A19)) IC1.79(PK4(A4/A12/A20)) IC1.80(PK5(A5/A13/A22)) IC1.81(PK6(A6/A14/A22)) IC1.82(PK7(A7/A15/A23)) IC1.88(PQ3) IC1.95(PA0(ADCA0/AREFA)) IC1.96(PA1(ADCA1)) IC1.97(PA2(ADCA2)) IC4.7(T2OUT) IC4.9(R2OUT) IC6.7(IO_VCC4) IC6.8(IO_VCC5) IC6.9(IO_VCC6) IC6.10(IO_VCC7) PDI_ATMEL.3(NC) PDI_ATMEL.4(NC.)

## Notes on the sheet
- manque connecteur status detection et leds pour etat detection

## Library data of the parts
ALIM = con-molex:22-?-04: CONNECTOR wire to board 2.54 mm (.1 inch) pitch header
C1-C56 = robotter_capacitor:C_
H1-H4 = holes:MOUNT-PAD-ROUND: MOUNTING PAD, round
IC1 = avr-7:XMEGA-A1: Atmel XMega A1 Series processor
IC2 IC5 IC6 = robotter:74LVC4245: octal transceiver buffer
IC3 = robotter_ic:LM1086CS-3.3
IC4 = robotter_ic:MAX3232: True RS-232 Transceivers 3.0V to 5.5V, Low-Power up to 1Mbps, Using Four 0.1µF External Capacitors Source: http://pdfserv.maxim-ic.com/en/ds/MAX3222-MAX3241.pdf
LED1-LED10 = robotter_diode:LED_MULTICOLOR; FARNELL: 1863245; MANUFACTURER: AVAGO TECHNOLOGIES; REFERENCE: ASMT-YTD2-0BB02
LED_K0 LED_K1-LED_K7 = robotter_diode:LED_
PDI_ATMEL = robotter_connector:PDI_ATMEL: Ref Harting : 09 18 506 7323 Atmel pdi connector
Q1 = robotter_ic:CRYSTAL_: CRYSTAL
R1-R74 R76-R89 = robotter_resistor:RES_
SENSOR_STATUS = con-harting-ml:ML26: HARTING
SW1-SW3 = robotter_others:SWITCH_0805
T1 T2 T5 T6 T9 T10 T13 T14 T17 T18 = robotter_ic:SFH3710: PHOTO TRANSISTOR
T3 T4 T7 T8 T11 T12 T15 T16 T19-T26 = transistor-neu-to92:*-NPN-: NPN Transistror
UART_I2C = robotter_connector:MICROMATCH-8_SMD: Ref FN : 1865096